# Altium schematic sheet CathodeControl.SchDoc
size A3; SheetNumber: 1; SheetTotal: 2
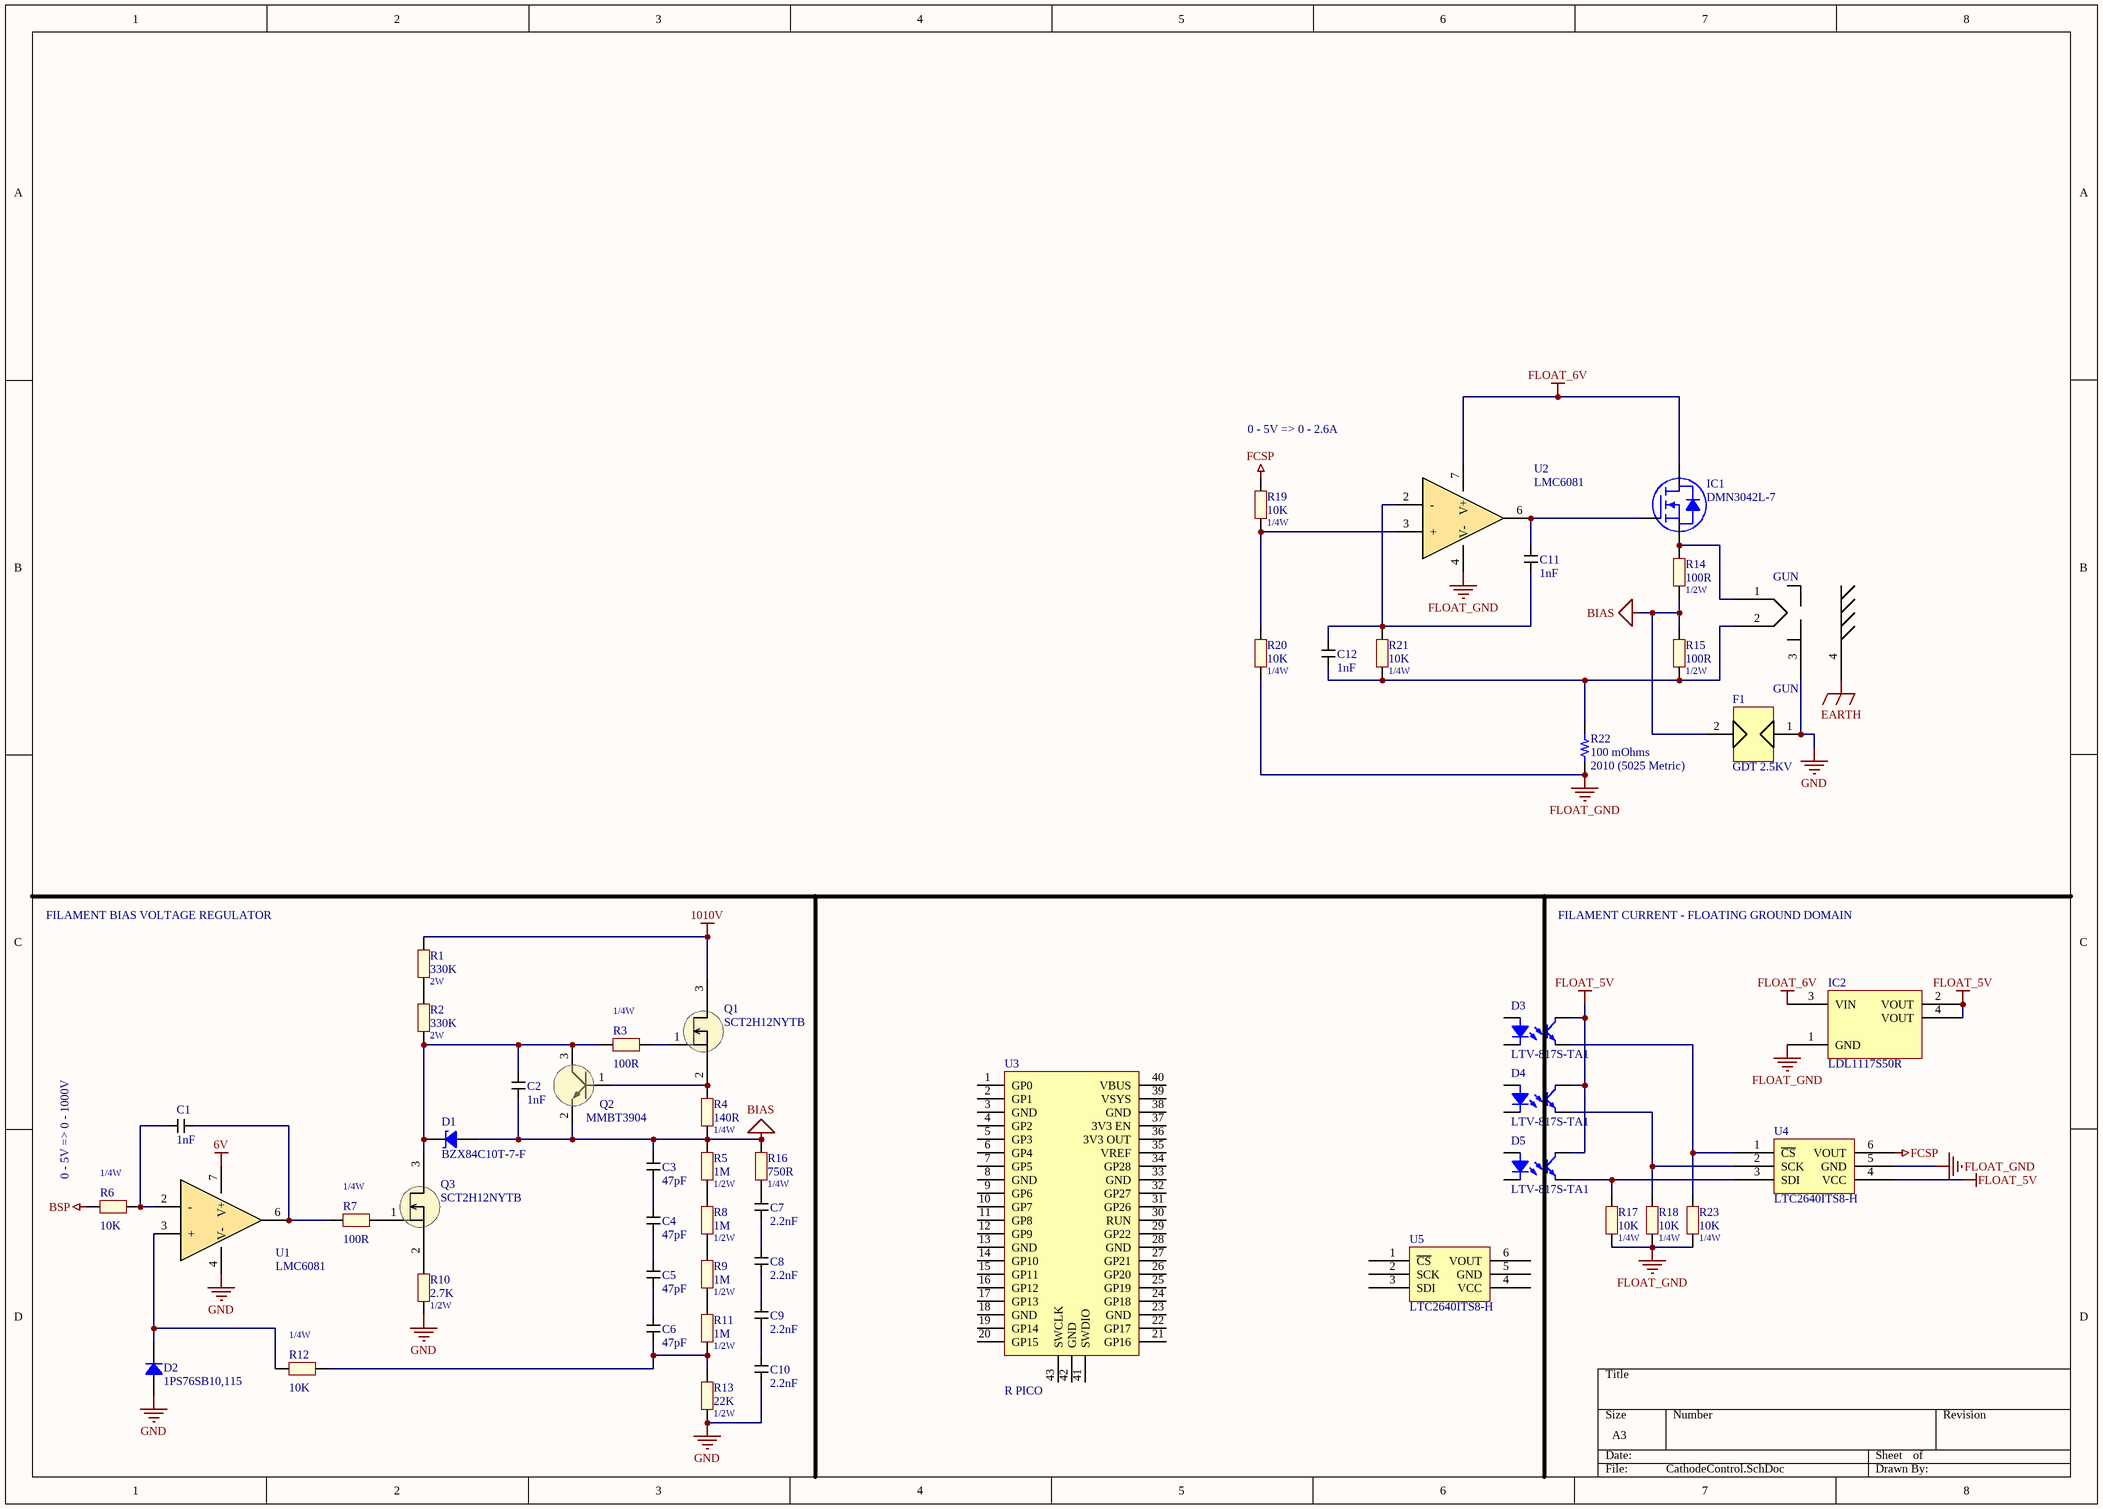
[diagram p0: CathodeControl.SchDoc]

## Parts
C1  1nF  [C0805]
C2  1nF  [C0805]
C3  47pF  [C0805]
C4  47pF  [C0805]
C5  47pF  [C0805]
C6  47pF  [C0805]
C7  2.2nF  [C0805]
C8  2.2nF  [C0805]
C9  2.2nF  [C0805]
C10  2.2nF  [C0805]
C11  1nF  [C0805]
C12  1nF  [C0805]
D1  BZX84C10T-7-F  [DIODES SOT-523]
D2  1PS76SB10,115  [SOD323]
D3  LTV-817S-TA1  [LITEON LTV-817]
D4  LTV-817S-TA1  [LITEON LTV-817]
D5  LTV-817S-TA1  [LITEON LTV-817]
F1  GDT 2.5KV  [GDT]
GUN  GUN
IC1  DMN3042L-7  [DIODES SOT-23-3]
IC2  LDL1117S50R  [ST SOT-223]
Q1  SCT2H12NYTB  [TO-268-2L]
Q2  MMBT3904  [SOT-23-3]
Q3  SCT2H12NYTB  [TO-268-2L]
R1  330K  Power: 2W  [R2512]
R2  330K  Power: 2W  [R2512]
R3  100R  Power: 1/4W  [R0805]
R4  140R  Power: 1/4W  [R0805]
R5  1M  Power: 1/2W  [R1206]
R6  10K  Power: 1/4W  [R0805]
R7  100R  Power: 1/4W  [R0805]
R8  1M  Power: 1/2W  [R1206]
R9  1M  Power: 1/2W  [R1206]
R10  2.7K  Power: 1/2W  [R1206]
R11  1M  Power: 1/2W  [R1206]
R12  10K  Power: 1/4W  [R0805]
R13  22K  Power: 1/2W  [R1206]
R14  100R  Power: 1/2W  [R1206]
R15  100R  Power: 1/2W  [R1206]
R16  750R  Power: 1/4W  [R0805]
R17  10K  Power: 1/4W  [R0805]
R18  10K  Power: 1/4W  [R0805]
R19  10K  Power: 1/4W  [R0805]
R20  10K  Power: 1/4W  [R0805]
R21  10K  Power: 1/4W  [R0805]
R22  100 mOhms  Package / Case: 2010 (5025 Metric)  [STACKPOLE CSR2010]
R23  10K  Power: 1/4W  [R0805]
U1  LMC6081  [SOIC-8]
U2  LMC6081  [SOIC-8]
U3  R PICO  [RPICO]
U4  LTC2640ITS8-H  [SC-70-6]
U5  LTC2640ITS8-H  [SC-70-6]

## Nets
6V: U1.7(V+)
1010V: Q1.3 R1.2
BIAS: C2.1 C3.2 D1.1 F1.2 Q2.2 R4.1 R5.2 R14.1 R15.2 R16.1
BSP: R6.2
EARTH: GUN.4
FCSP: R19.1 U4.6(VOUT)
FLOAT_5V: D3.4 D4.4 D5.4 IC2.2(VOUT) IC2.4(VOUT) U4.4(VCC)
FLOAT_6V: IC1.3(D) IC2.3(VIN) U2.7(V+)
FLOAT_GND: IC2.1(GND) R17.2 R18.2 R20.2 R22.1 R23.2 U2.4(V-) U4.5(GND)
GND: C10.1 D2.1 F1.1 GUN.3 R10.1 R13.1 U1.4(V-)
NetC1_1: C1.1 R7.2 U1.6
NetC1_2: C1.2 R6.1 U1.2(-)
NetC2_2: C2.2 D1.2 Q2.3 Q3.3 R2.1 R3.2
NetC3_1: C3.1 C4.2
NetC4_1: C4.1 C5.2
NetC5_1: C5.1 C6.2
NetC6_1: C6.1 R11.1 R12.1 R13.2
NetC7_1: C7.1 C8.2
NetC7_2: C7.2 R16.2
NetC8_1: C8.1 C9.2
NetC9_1: C9.1 C10.2
NetC11_1: C11.1 IC1.1(G) U2.6
NetC11_2: C11.2 C12.1 R21.1 U2.2(-)
NetC12_2: C12.2 GUN.2 R15.1 R21.2 R22.2
NetD2_2: D2.2 R12.2 U1.3(+)
NetD3_3: D3.3 R23.1 U4.1(~{CS})
NetD4_3: D4.3 R18.1 U4.2(SCK)
NetD5_3: D5.3 R17.1 U4.3(SDI)
NetGUN_1: GUN.1 IC1.2(S) R14.2
NetQ1_1: Q1.1 R3.1
NetQ1_2: Q1.2 Q2.1 R4.2
NetQ3_1: Q3.1 R7.1
NetQ3_2: Q3.2 R10.2
NetR1_1: R1.1 R2.2
NetR5_1: R5.1 R8.2
NetR8_1: R8.1 R9.2
NetR9_1: R9.1 R11.2
NetR19_2: R19.2 R20.1 U2.3(+)

Not connected (* = marked no-connect by the designer): D3 1 2; D4 1 2; D5 1 2; U3 1(GP0) 2(GP1) 3(GND) 4(GP2) 5(GP3) 6(GP4) 7(GP5) 8(GND) 9(GP6) 10(GP7) 11(GP8) 12(GP9) 13(GND) 14(GP10) 15(GP11) 16(GP12) 17(GP13) 18(GND) 19(GP14) 20(GP15) 21(GP16) 22(GP17) 23(GND) 24(GP18) 25(GP19) 26(GP20) 27(GP21) 28(GND) 29(GP22) 30(RUN) 31(GP26) 32(GP27) 33(GND) 34(GP28) 35(VREF) 36(3V3_OUT) 37(3V3_EN) 38(GND) 39(VSYS) 40(VBUS) 41(SWDIO) 42(GND) 43(SWCLK); U5 1(~{CS}) 2(SCK) 3(SDI) 4(VCC) 5(GND) 6(VOUT)

## Notes on the sheet
- 0 - 5V => 0 - 2.6A
- FILAMENT BIAS VOLTAGE REGULATOR
- FILAMENT CURRENT - FLOATING GROUND DOMAIN
- (near R6) 0 - 5V => 0 - 1000V

## Library data of the parts
C1 C2 C7-C12 = C0805
  C1 C2 C11 C12: Capacitance: 1nF
  C7-C10: Capacitance: 2.2nF
C3-C6 = 885342007006: 47 pF ±5% 500V Ceramic Capacitor C0G, NP0 0805 (2012 Metric); Capacitance: 47pF; Supplier 1: Digi-Key; Supplier Part Number 1: 732-12170-1-ND
D1 = BZX84C10T-7-F: DIODE ZENER 10V 150MW SOT523; Manufacturer: Diodes Incorporated; Current - Reverse Leakage @ Vr: 200 nA @ 7 V; Impedance (Max) (Zzt): 20 Ohms; Tolerance: ±6%; Voltage - Forward (Vf) (Max) @ If: 900 mV @ 10 mA; Part Number: BZX84C10T-7-F; ComponentLink1Description: Datasheet; ComponentLink1URL: https://www.diodes.com/assets/Datasheets/ds30262.pdf; ComponentLink2Description: DigiKey Link; ComponentLink2URL: https://www.digikey.com/en/products/detail/diodes-incorporated/BZX84C10T-7-F/1142229; LastUpdated: 4/12/2022 10:53:00 PM; Lifecycle Status: Active; Minimum Order: 1; Mounting Type: Surface Mount; Operating Temperature: -65°C ~ 150°C; Package / Case: SOT-523; Packaging: TapeAndReel; PartId: 778; Part Status: Active; Power - Max: 150 mW; Price: 0.05; Series: -; Supplier 1: DigiKey; Supplier Part Number 1: BZX84C10T-FDICT-ND; Supplier Device Package: SOT-523; Voltage - Zener (Nom) (Vz): 10 V
D2 = 1PS76SB10,115: DIODE SCHOTTKY 30V 200MA SOD323; Manufacturer: Nexperia USA Inc.; Capacitance @ Vr, F: 10pF @ 1V, 1MHz; Current - Average Rectified (Io): 200mA (DC); Current - Reverse Leakage @ Vr: 2 µA @ 25 V; Speed: Small Signal =< 200mA (Io), Any Speed; Voltage - Forward (Vf) (Max) @ If: 800 mV @ 100 mA; Part Number: 1PS76SB10,115; ComponentLink1Description: Datasheet; ComponentLink1URL: https://assets.nexperia.com/documents/data-sheet/1PS76SB10.PDF; ComponentLink2Description: DigiKey Link; ComponentLink2URL: https://www.digikey.com/en/products/detail/nexperia-usa-inc/1PS76SB10-115/1127159; Diode Type: Schottky; LastUpdated: 4/12/2022 11:03:32 PM; Lifecycle Status: Active; Minimum Order: 1; Mounting Type: Surface Mount; Operating Temperature - Junction: 125°C (Max); Package / Case: SC-76, SOD-323; Packaging: TapeAndReel; PartId: 2999; Part Status: Active; Price: 0.03; Series: Automotive, AEC-Q101; Supplier 1: DigiKey; Supplier Part Number 1: 1727-3561-1-ND; Supplier Device Package: SOD-323; Voltage - DC Reverse (Vr) (Max): 30 V
D3-D5 = LTV-817S-TA1: OPTOISOLATR 5KV TRANSISTOR 4-SMD; Manufacturer: Lite-On Inc.; Current - DC Forward (If) (Max): 50mA; Current Transfer Ratio (Max): 600% @ 5mA; Current Transfer Ratio (Min): 50% @ 5mA; Input Type: DC; Number of Channels: 1; Rise / Fall Time (Typ): 4µs, 3µs; Vce Saturation (Max): 200mV; Voltage - Forward (Vf) (Typ): 1.2V; Voltage - Isolation: 5000Vrms; Voltage - Output (Max): 35V; Part Number: LTV-817S-TA1; ComponentLink1Description: Datasheet; ComponentLink1URL: http://optoelectronics.liteon.com/upload/download/DS-70-96-0016/LTV-8X7%20series%20201610%20.pdf; ComponentLink2Description: DigiKey Link; ComponentLink2URL: http://digikey.com/product-detail/en/lite-on-inc/LTV-817S-TA1/160-1893-1-ND/3306757; Current - Output / Channel: 50mA; Device Package: 4-SMD, Gull Wing; LastUpdated: 1/12/2020 9:58:48 PM; Lifecycle Status: Active; Minimum Order: 1; Mounting Type: Surface Mount; Operating Temperature: -30°C ~ 110°C; Output Type: Transistor; Package / Case: 4-SMD, Gull Wing; Packaging: TapeAndReel; Part Status: Active; Price: 0.12; Series: -; Supplier 1: DigiKey; Supplier Part Number 1: 160-1893-1-ND; Supplier Device Package: 4-SMD
F1 = B88069X2500T502: Gas Discharge Tube 2500 V 2000A (2kA) ±20% 2 Pole Through Hole
IC1 = DMN3042L-7: MOSFET N-CH 30V 5.8A SOT23; Manufacturer: Diodes Incorporated; Current - Continuous Drain (Id) @ 25°C: 5.8A (Ta); Drive Voltage (Max Rds On,  Min Rds On): 2.5V, 10V; FET Type: N-Channel; Gate Charge (Qg) (Max) @ Vgs: 20 nC @ 10 V; Input Capacitance (Ciss) (Max) @ Vds: 860 pF @ 15 V; Power Dissipation (Max): 720mW (Ta); Rds On (Max) @ Id, Vgs: 26.5mOhm @ 5.8A, 10V; Vgs (Max): ±12V; Vgs(th) (Max) @ Id: 1.4V @ 250µA; Part Number: DMN3042L-7; ComponentLink1Description: Datasheet; ComponentLink1URL: https://www.diodes.com/assets/Datasheets/DMN3042L.pdf; ComponentLink2Description: DigiKey Link; ComponentLink2URL: https://www.digikey.com/en/products/detail/diodes-incorporated/DMN3042L-7/5223209; Drain to Source Voltage (Vdss): 30 V; LastUpdated: 4/12/2022 11:00:46 PM; Lifecycle Status: Active; Minimum Order: 1; Mounting Type: Surface Mount; Operating Temperature: -55°C ~ 150°C (TJ); Package / Case: TO-236-3, SC-59, SOT-23-3; Packaging: TapeAndReel; Part Status: Active; Price: 0.10; Series: -; Supplier 1: DigiKey; Supplier Part Number 1: DMN3042L-7DICT-ND; Supplier Device Package: SOT-23-3; Technology: MOSFET (Metal Oxide)
IC2 = LDL1117S50R: IC REG LINEAR 5V 1.2A SOT223; Manufacturer: STMicroelectronics; Current - Quiescent (Iq): 500µA; Number of Regulators: 1; Output Configuration: Positive; Output Type: Fixed; Protection Features: Over Current, Over Temperature, Under Voltage Lockout (UVLO); PSRR: 87dB ~ 65dB (120Hz ~ 100kHz); Voltage Dropout (Max): 0.6V @ 1.2A; Voltage - Input (Max): 18V; Part Number: LDL1117S50R; ComponentLink1Description: Datasheet; ComponentLink1URL: http://www.st.com/content/ccc/resource/technical/document/datasheet/group3/0e/5a/00/ca/10/1a/4f/a5/DM00366442/files/DM00366442.pdf/jcr:content/translations/en.DM00366442.pdf; ComponentLink2Description: DigiKey Link; ComponentLink2URL: http://digikey.com/product-detail/en/stmicroelectronics/LDL1117S50R/497-17240-1-ND/7102080; Current - Output: 1.2A; LastUpdated: 4/12/2022 11:08:41 PM; Lifecycle Status: Active; Minimum Order: 1; Mounting Type: Surface Mount; Operating Temperature: -40°C ~ 125°C (TJ); Package / Case: TO-261-4, TO-261AA; Packaging: TapeAndReel; Part Status: Active; Price: 0.12; Series: -; Supplier 1: DigiKey; Supplier Part Number 1: 497-17240-1-ND; Supplier Device Package: SOT-223; Voltage - Output (Min/Fixed): 5V
Q1 Q3 = SCT2H12NYTB: N-MOSFET 1700V 4A; Supplier 1: Digi-Key; Supplier Part Number 1: SCT2H12NYTBTR-ND
Q2 = MMBT3904_1: BIPOLAR NPN Transistor; Supplier 1: Mouser; Supplier 2: Digi-Key; Supplier Part Number 1: 863-MMBT3904LT1G; Supplier Part Number 2: MMBT3904LT1GOSDKR-ND
R1 R2 = R2W: Resistor 2W; Resistance: 330K
R3 R4 R6 R7 R12 R16-R21 R23 = R0.25W: Resistor 1/2W
  R3 R7: Resistance: 100R
  R4: Resistance: 140R
  R6 R12 R17-R21 R23: Resistance: 10K
  R16: Resistance: 750R
R5 R8-R11 R13-R15 = R0.5W: Resistor 1/2W
  R5 R8 R9 R11: Resistance: 1M
  R10: Resistance: 2.7K
  R13: Resistance: 22K
  R14 R15: Resistance: 100R
R22 = ERJ-B1CFR10U: RES 0.1 OHM 2W 2010 WIDE; Manufacturer: Panasonic Electronic Components; Temperature Coefficient: ±100ppm/°C; Tolerance: ±1%; Part Number: ERJ-B1CFR10U; ComponentLink1Description: Datasheet; ComponentLink1URL: http://industrial.panasonic.com/www-cgi/jvcr13pz.cgi?E+PZ+4+AOA0023+ERJB1CFR10U+8+WW; ComponentLink2Description: DigiKey Link; ComponentLink2URL: https://www.digikey.com/en/products/detail/panasonic-electronic-components/ERJ-B1CFR10U/2795283; Composition: Thick Film; Device Package: 2010 (5025 Metric); Features: Automotive AEC-Q200, Current Sense; Height - Seated (Max): 0.030" (0.75mm); LastUpdated: 4/12/2022 10:45:51 PM; Lifecycle Status: Active; Minimum Order: 1; Number of Terminations: 2; Operating Temperature: -55°C ~ 155°C; Packaging: TapeAndReel; PartId: 2967; Part Status: Active; Power (Watts): 2W; Price: 0.59; Ratings: AEC-Q200; Resistance: 100 mOhms; Series: ERJ-B1; Size / Dimension: 0.098" L x 0.197" W (2.50mm x 5.00mm); Supplier 1: DigiKey; Supplier Part Number 1: P18941CT-ND; Supplier Device Package: 1020; Value: 100 mOhms
U1 U2 = LMC6081: Low offset voltage: 150 μV Operates from 4.5V to 15V single supply Ultra low input bias current: 10 fA; Supplier 1: Digi-Key; Supplier Part Number 1: 296-35439-1-ND
U3 = RaspPico
U4 U5 = LTC2640ITS8-HZ12: Supplier 1: Digi-Key; Supplier Part Number 1: LTC2640ITS8-HZ12#TRMPBFCT-ND